# Altium schematic sheet 3 Bias Supply.SchDoc
size A
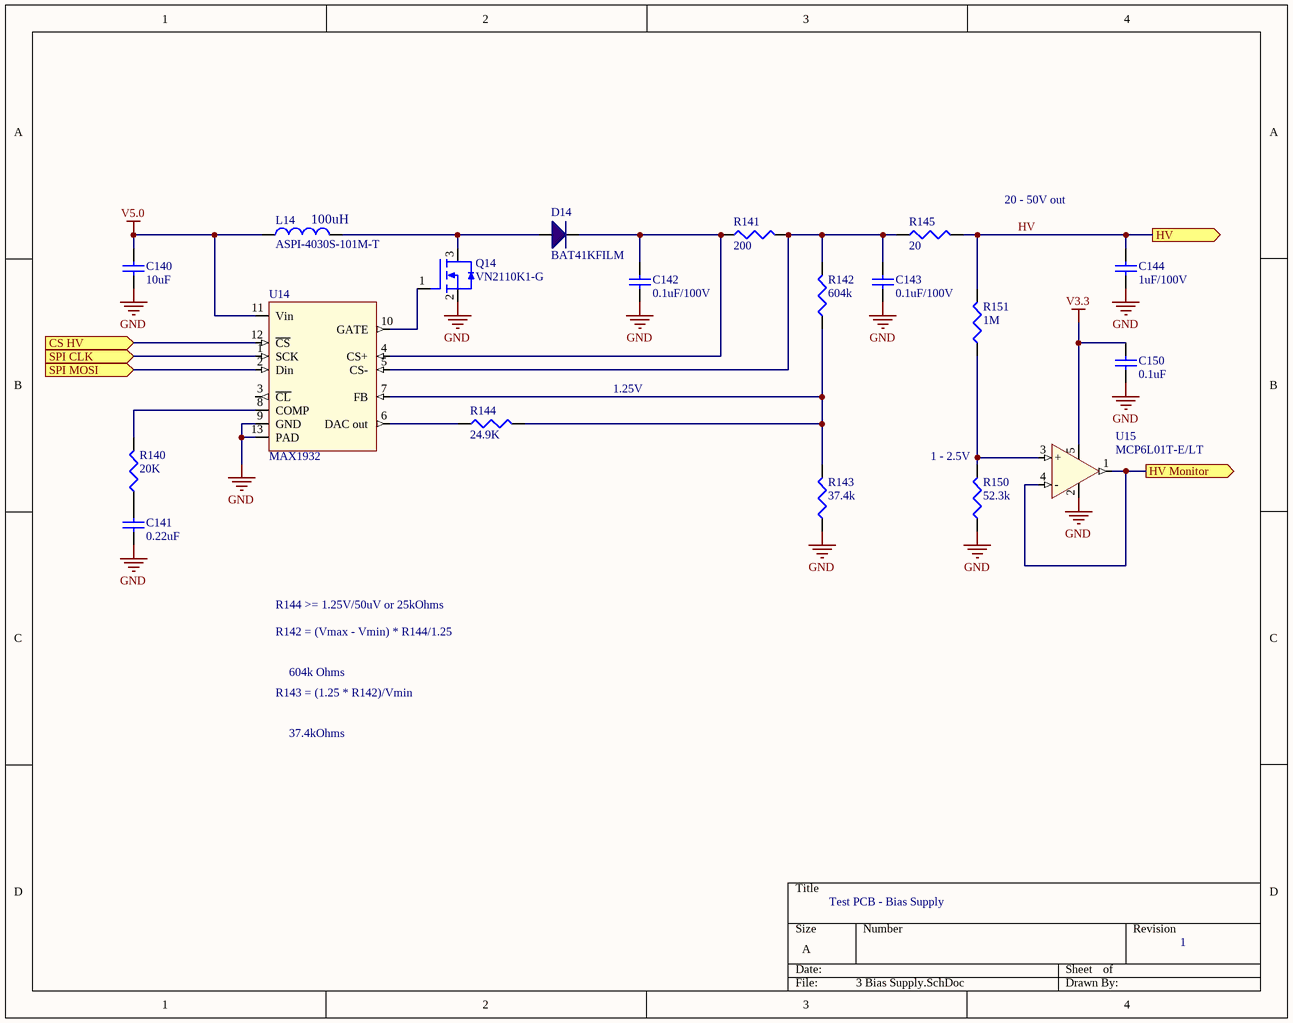
[diagram p0: 3 Bias Supply.SchDoc]

## Parts
C140  10uF  [C0805]
C141  0.22uF  [C0603]
C142  0.1uF/100V  [C0603]
C143  0.1uF/100V  [C0603]
C144  1uF/100V  [C0805]
C150  0.1uF  [C0402]
D14  BAT41KFILM  [SOD523]
L14  ASPI-4030S-101M-T  Inductance: 100uH  [L_4018]
Q14  VN2110K1-G  [SOT23-3]
R140  20K  [R0603]
R141  200  [R0603]
R142  604k  [R0603]
R143  37.4k  [R0603]
R144  24.9K  [R0603]
R145  20  [R0603]
R150  52.3k  [R0603]
R151  1M  [R0603]
U14  MAX1932  [QFN127P600-12N]
U15  MCP6L01T-E/LT  [SOT23-5]

## Ports
CS HV (in), HV (out), HV Monitor (out), SPI CLK (in), SPI MOSI (in)

## Nets
GND: C140.1 C141.1 C142.1 C143.1 C144.1 C150.1 Q14.2 R143.1 R150.1 U14.9(GND) U14.13(PAD) U15.2(GND)
V3.3: C150.2 U15.5(Vdd)
V5.0: C140.2 L14.1 U14.11(Vin)
CS HV: U14.12(~{CS}) ; port CS HV
HV: C144.2 R145.2 R151.2 ; port HV
HV Monitor: U15.1(Vout) U15.4(-) ; port HV Monitor
SPI CLK: U14.1(SCK) ; port SPI CLK
SPI MOSI: U14.2(Din) ; port SPI MOSI
NetC141_2: C141.2 R140.1
NetC142_2: C142.2 D14.2(K) R141.1 U14.4(CS+)
NetC143_2: C143.2 R141.2 R142.2 R145.1 U14.5(CS-)
NetD14_1: D14.1(A) L14.2 Q14.3
NetQ14_1: Q14.1 U14.10(GATE)
NetR140_2: R140.2 U14.8(COMP)
NetR142_1: R142.1 R143.2 R144.2 U14.7(FB)
NetR144_1: R144.1 U14.6(DAC_out)
NetR150_2: R150.2 R151.1 U15.3(+)

Not connected (* = marked no-connect by the designer): U14 3(~{CL})

## Notes on the sheet
- 20 - 50V out
- 1.25V
- (near R150) 1 - 2.5V
- R144 >= 1.25V/50uV or 25kOhms
- R142 = (Vmax - Vmin) * R144/1.25
- R143 = (1.25 * R142)/Vmin
- 604k Ohms
- 37.4kOhms
- Test PCB - Bias Supply
- 1

## Library data of the parts
C140-C144 C150 = Cap SM: Capacitor, SM; Published: 8-Jun-2000; LatestRevisionDate: 29-May-2009; LatestRevisionNote: IPC-7351 Footprint Added.; PackageReference: C1206; Publisher: Altium Limited; PackageDescription: Chip Capacitor
  C140: Value: 10uF
  C141: Value: 0.22uF
  C142 C143: Value: 0.1uF/100V
  C144: Value: 1uF/100V
  C150: Value: 0.1uF
D14 = BAT41KFILM: Schottky diode; Part Number: BAT41KFILM
L14 = Inductor: 47uH inductor; Part Number: ASPI-4030S-101M-T
Q14 = N FET: Part Number: DMN10H220L-7
R140-R145 R150 R151 = Res SM: Resistor; Published: 8-Jun-2000; LatestRevisionDate: 29-May-2009; LatestRevisionNote: IPC-7351 Footprint Added.; PackageReference: J1-0603; Publisher: Altium Limited; PackageDescription: Chip Resistor
  R140: Value: 20K
  R141: Value: 200
  R142: Value: 604k
  R143: Value: 37.4k
  R144: Value: 24.9K
  R145: Value: 20
  R150: Value: 52.3k
  R151: Value: 1M
U14 = MAX1932: APD bias supply; Part Number: MAX1932
U15 = MCP6L01: Op amp RRIO; Part Number: MCP6L01T-E/LT